# Altium schematic sheet SoundChip.SchDoc
size A
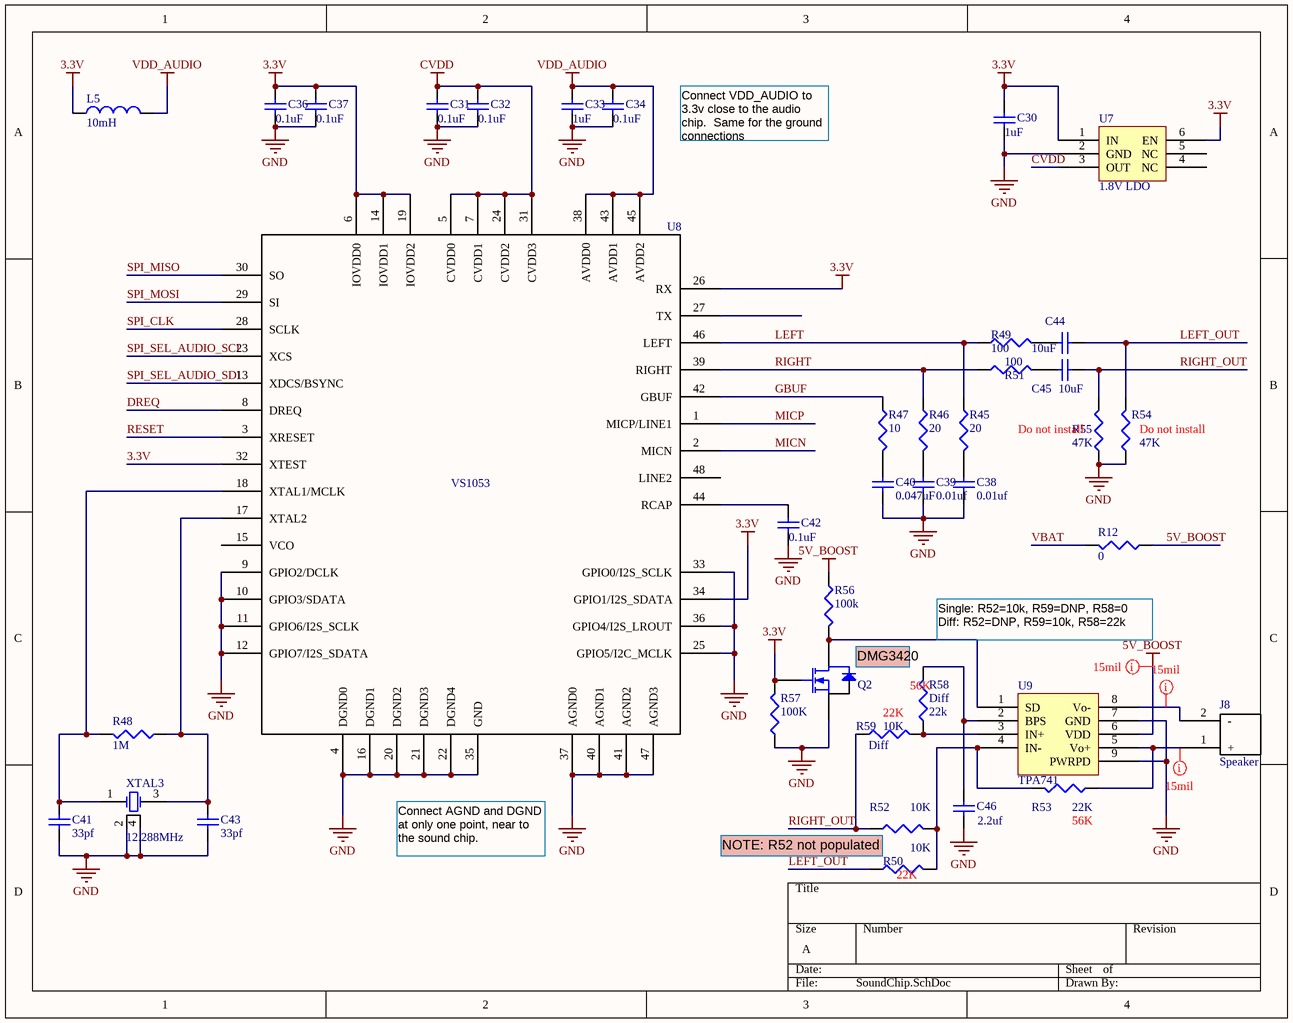
[diagram p0: SoundChip.SchDoc]

## Parts
C30  value 1uF  [CAPC1608L]  (hidden comment: Cap Semi)
C31  value 0.1uF  [CAPC1005L]  (hidden comment: Cap Semi)
C32  value 0.1uF  [CAPC1005L]  (hidden comment: Cap Semi)
C33  value 1uF  [CAPC1608L]  (hidden comment: Cap Semi)
C34  value 0.1uF  [CAPC1005L]  (hidden comment: Cap Semi)
C36  value 0.1uF  [CAPC1005L]  (hidden comment: Cap Semi)
C37  value 0.1uF  [CAPC1005L]  (hidden comment: Cap Semi)
C38  value 0.01uf  [CAPC1005L]  (hidden comment: Cap Semi)
C39  value 0.01uf  [CAPC1005L]  (hidden comment: Cap Semi)
C40  value 0.047uF  [CAPC1005L]  (hidden comment: Cap Semi)
C41  value 33pf  [CAPC1005L]  (hidden comment: Cap Semi)
C42  value 0.1uF  [CAPC1005L]  (hidden comment: Cap Semi)
C43  value 33pf  [CAPC1005L]  (hidden comment: Cap Semi)
C44  value 10uF  [CAPC1608L]  (hidden comment: Cap Semi)
C45  value 10uF  [CAPC1608L]  (hidden comment: Cap Semi)
C46  value 2.2uf  [CAPC1608L]  (hidden comment: Cap Semi)
J8  Speaker  [BatteryConnJST]
L5  value 10mH  [INDC2012L]  (hidden comment: Inductor)
Q2  Mosfet  [SOT-23]  (value not drawn)
R12  value 0  [RESC1608L]  (hidden comment: Res3)
R45  value 20  [RESC1608L]  (hidden comment: Res3)
R46  value 20  [RESC1608L]  (hidden comment: Res3)
R47  value 10  [RESC1608L]  (hidden comment: Res3)
R48  value 1M  [RESC1608L]  (hidden comment: Res3)
R49  value 100  [RESC1608L]  (hidden comment: Res3)
R50  value 10K  [RESC1608L]  (hidden comment: Res3)
R51  value 100  [RESC1608L]  (hidden comment: Res3)
R52  value 10K  [RESC1608L]  (hidden comment: Res3)
R53  value 22K  [RESC1608L]  (hidden comment: Res3)
R54  value 47K  [RESC1608L]  (hidden comment: Res3)
R55  value 47K  [RESC1608L]  (hidden comment: Res3)
R56  value 100k  [RESC1608L]  (hidden comment: Res3)
R57  value 100K  [RESC1608L]  (hidden comment: Res3)
R58  Diff  value 22k  [RESC1608L]
R59  Diff  value 10K  [RESC1608L]
U7  1.8V LDO  [WFDFN-6]
U8  VS1053  [LQFP-48]
U9  TPA741  [audio amp]
XTAL3  12.288MHz  [CRYSTAL]

## Nets
3.3V: C30.1 C36.2 C37.2 L5.2 Q2.1(G) R57.2 U7.1(IN) U7.6(EN) U8.6(IOVDD0) U8.14(IOVDD1) U8.19(IOVDD2) U8.26(RX) U8.32(XTEST) U8.34(GPIO1/I2S_SDATA)
5V_BOOST: R12.1 R56.2 U9.6(VDD)
CVDD: C31.2 C32.2 U7.3(OUT) U8.5(CVDD0) U8.7(CVDD1) U8.24(CVDD2) U8.31(CVDD3)
GND: C30.2 C31.1 C32.1 C33.2 C34.1 C36.1 C37.1 C38.2 C39.2 C40.2 C41.2 C42.1 C43.2 C46.1 Q2.2(S) R54.1 R55.1 R57.1 U7.2(GND) U8.4(DGND0) U8.9(GPIO2/DCLK) U8.10(GPIO3/SDATA) U8.11(GPIO6/I2S_SCLK) U8.12(GPIO7/I2S_SDATA) U8.16(DGND1) U8.20(DGND2) U8.21(DGND3) U8.22(DGND4) U8.25(GPIO5/I2C_MCLK) U8.33(GPIO0/I2S_SCLK) U8.35(GND) U8.36(GPIO4/I2S_LROUT) U8.37(AGND0) U8.40(AGND1) U8.41(AGND2) U8.47(AGND3) U9.7(GND) U9.9(PWRPD) XTAL3.2(GND) XTAL3.4(GND)
VDD_AUDIO: C33.1 C34.2 L5.1 U8.38(AVDD0) U8.43(AVDD1) U8.45(AVDD2)
DREQ: U8.8(DREQ)
GBUF: R47.1 U8.42(GBUF)
LEFT: R45.1 R49.1 U8.46(LEFT)
LEFT_OUT: C44.1 R50.1 R54.2
MICN: U8.2(MICN)
MICP: U8.1(MICP/LINE1)
RESET: U8.3(XRESET)
RIGHT: R46.1 R51.1 U8.39(RIGHT)
RIGHT_OUT: C45.1 R52.1 R55.2 R59.1
SPI_CLK: U8.28(SCLK)
SPI_MISO: U8.30(SO)
SPI_MOSI: U8.29(SI)
SPI_SEL_AUDIO_SCI: U8.23(XCS)
SPI_SEL_AUDIO_SDI: U8.13(XDCS/BSYNC)
VBAT: R12.2
NetC38_1: C38.1 R45.2
NetC39_1: C39.1 R46.2
NetC40_1: C40.1 R47.2
NetC41_1: C41.1 R48.2 U8.18(XTAL1/MCLK) XTAL3.1(OSC1)
NetC42_2: C42.2 U8.44(RCAP)
NetC43_1: C43.1 R48.1 U8.17(XTAL2) XTAL3.3(OSC2)
NetC44_2: C44.2 R49.2
NetC45_2: C45.2 R51.2
NetC46_2: C46.2 R58.2 U9.2(BPS)
NetJ8_1: J8.1(+) R53.1 U9.5(Vo+)
NetJ8_2: J8.2(-) U9.8(Vo-)
NetQ2_3: Q2.3(D) R56.1 U9.1(SD)
NetR50_2: R50.2 R52.2 R53.2 U9.4(IN-)
NetR58_1: R58.1 R59.2 U9.3(IN+)

Not connected (* = marked no-connect by the designer): U7 4(NC) 5(NC); U8 15(VCO) 27(TX) 48(LINE2)

## Layout directives
rule Width Constraint [Pref Width = 15mil    Min Width = 8mil    Max Width = 20mil]: 5V_BOOST, NetJ8_1, NetJ8_2

## Notes on the sheet
- Connect VDD_AUDIO to 3.3v close to the audio chip.  Same for the ground connections
- (near R55) Do not install
- (near R54) Do not install
- Single: R52=10k, R59=DNP, R58=0
  Diff: R52=DNP, R59=10k, R58=22k
- DMG3420
- (near R58) 56K
- 22K
- (near R53) 56K
- Connect AGND and DGND at only one point, near to the sound chip.
- NOTE: R52 not populated
- (near R50) 22K

## Library data of the parts
C30-C34 C36-C46 = Cap Semi: Capacitor (Semiconductor SIM Model); Published: 8-Jun-2000; LatestRevisionDate: 29-May-2009; LatestRevisionNote: IPC-7351 Footprint Added.; PackageReference: C1206; Publisher: Altium Limited; PackageDescription: Chip Capacitor
J8 = BatteryConnJST
L5 = Inductor: Code_IEC: 1005; Published: 8-Jun-2000; LatestRevisionDate: 29-May-2009; LatestRevisionNote: IPC-7351 Footprint Added.; PackageReference: 0402-A; Publisher: Altium Limited; PackageDescription: Chip Inductor; Code_JEITA: 0402
R12 R45-R59 = Res3: Resistor; Published: 8-Jun-2000; LatestRevisionDate: 29-May-2009; LatestRevisionNote: IPC-7351 Footprint Added.; PackageReference: J1-0603; Publisher: Altium Limited; PackageDescription: Chip Resistor
U7 = 1.8V_LDO
U9 = Audio Amp TPA741
XTAL3 = Crystal